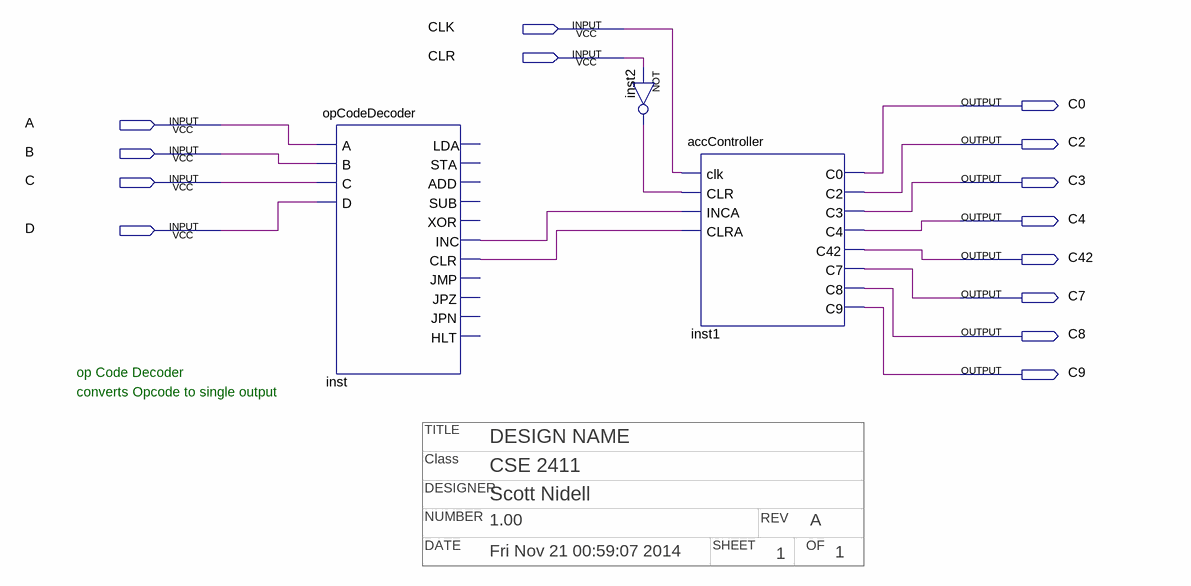
[diagram p0: schematic sheet]
// Quartus schematic accControl.bdf as structural Verilog: 3 symbols, 14 pins
// Title block: Class: CSE 2411; DATE: Fri Nov 21 00:59:07 2014; DESIGNER: Scott Nidell; NUMBER: 1.00; OF: 1; REV: A; SHEET: 1; TITLE: DESIGN NAME
module accControl (
  input  CLK,
  input  CLR,
  input  A,
  input  B,
  input  C,
  input  D,
  output C0,
  output C2,
  output C3,
  output C4,
  output C42,
  output C7,
  output C8,
  output C9
);

  wire inst2_out, inst_clr, inst_inc;

  opCodeDecoder inst (
    .A(A), .B(B), .C(C), .D(D), .INC(inst_inc), .CLR(inst_clr));  // open: LDA, STA, ADD, SUB, XOR, JMP, JPZ, JPN, HLT
  not inst2 (inst2_out, CLR);
  accController inst1 (
    .clk(CLK), .CLR(inst2_out), .INCA(inst_inc), .CLRA(inst_clr), .C0(C0), .C2(C2), .C3(C3), .C4(C4),
    .C42(C42), .C7(C7), .C8(C8), .C9(C9));

  // Notes on the sheet:
  //   op Code Decoder
  //   converts Opcode to single output
endmodule
